# EAGLE design LabDuinoPorts (EAGLE 7.2.0)
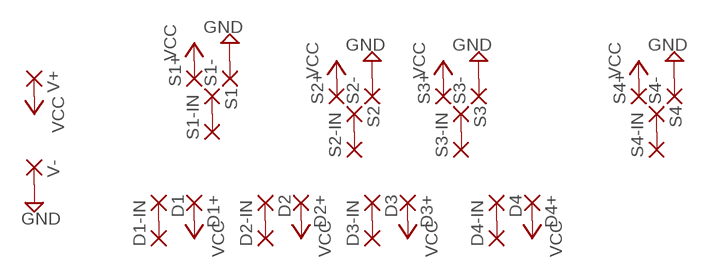
[diagram p0: schematic, sheet 1]

## Parts
D1  2,54/0,9  [2,54/0,9]
D1+  2,54/0,9  [2,54/0,9]
D1-IN  2,54/0,9  [2,54/0,9]
D2  2,54/0,9  [2,54/0,9]
D2+  2,54/0,9  [2,54/0,9]
D2-IN  2,54/0,9  [2,54/0,9]
D3  2,54/0,9  [2,54/0,9]
D3+  2,54/0,9  [2,54/0,9]
D3-IN  2,54/0,9  [2,54/0,9]
D4  2,54/0,9  [2,54/0,9]
D4+  2,54/0,9  [2,54/0,9]
D4-IN  2,54/0,9  [2,54/0,9]
S1  2,54/0,9  [2,54/0,9]
S1+  2,54/0,9  [2,54/0,9]
S1-  2,54/0,9  [2,54/0,9]
S1-IN  2,54/0,9  [2,54/0,9]
S2  2,54/0,9  [2,54/0,9]
S2+  2,54/0,9  [2,54/0,9]
S2-  2,54/0,9  [2,54/0,9]
S2-IN  2,54/0,9  [2,54/0,9]
S3  2,54/0,9  [2,54/0,9]
S3+  2,54/0,9  [2,54/0,9]
S3-  2,54/0,9  [2,54/0,9]
S3-IN  2,54/0,9  [2,54/0,9]
S4  2,54/0,9  [2,54/0,9]
S4+  2,54/0,9  [2,54/0,9]
S4-  2,54/0,9  [2,54/0,9]
S4-IN  2,54/0,9  [2,54/0,9]
V+  2,54/0,9  [2,54/0,9]
V-  2,54/0,9  [2,54/0,9]

## Nets
GND: S1-.1(P) S2-.1(P) S3-.1(P) S4-.1(P) V-.1(P)
N$1: S1-IN.1(P) S1.1(P)
N$2: S2-IN.1(P) S2.1(P)
N$3: S3-IN.1(P) S3.1(P)
N$4: S4-IN.1(P) S4.1(P)
N$5: D1-IN.1(P) D1.1(P)
N$6: D2-IN.1(P) D2.1(P)
N$7: D3-IN.1(P) D3.1(P)
N$8: D4-IN.1(P) D4.1(P)
VCC: D1+.1(P) D2+.1(P) D3+.1(P) D4+.1(P) S1+.1(P) S2+.1(P) S3+.1(P) S4+.1(P) V+.1(P)

## Library data of the parts
D1 D1+ D1-IN D2 D2+ D2-IN D3 D3+ D3-IN D4 D4+ D4-IN S1 S1+ S1- S1-IN S2 S2+ S2- S2-IN S3 S3+ S3- S3-IN S4 S4+ S4- S4-IN V+ V- = wirepad:2,54/0,9: THROUGH-HOLE PAD

## Net classes
0 default: width 0.381 mm, clearance 0.508 mm

## Board
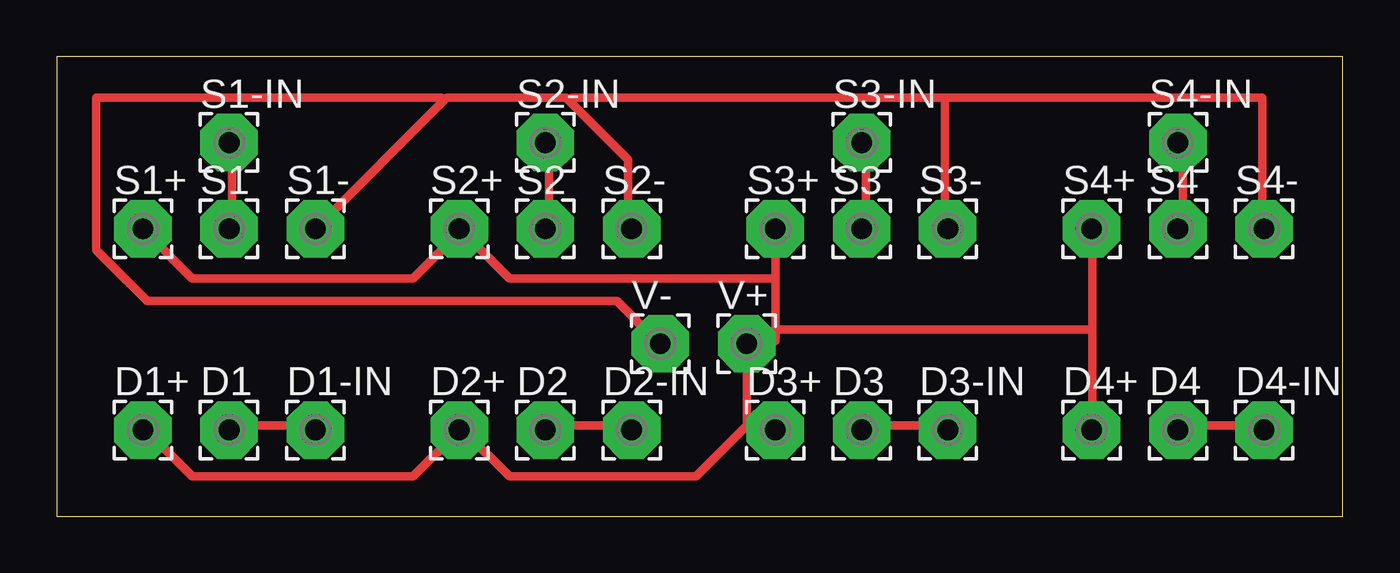
[diagram p1: board, top side]

Size 56.82 x 20.31 mm. Coordinates in mm from the lower left corner, seen from the top.
Outline: 0,0 56.82,0 56.82,20.31 0,20.31 0,0
Copper layers (1*16): Top 0.035mm / dielectric 1.5mm / Bottom 0.035mm
Design rules "default": minimum track width 10mil, minimum drill 24mil, track to track 8mil, track to pad 8mil, pad to pad 8mil, via to via 8mil, smd to smd 8mil, copper to edge 40mil, drill to drill 8mil, minimum pad ring 10mil, minimum via ring 8mil, stop-mask expansion 4mil, vias tented up to drill 0mil, thermal gap 10mil

### Footprints (pad centres in the part's own frame; a part is rotated, then mirrored left to right if it is on the bottom)
2,54/0,9 = drill 0.914 pad 2.54 octagon: 1 0,0

### Placement (x,y rotation side)
D1  7.62,3.81 0 top
D1+  3.81,3.81 0 top
D1-IN  11.43,3.81 0 top
D2  21.59,3.81 0 top
D2+  17.78,3.81 0 top
D2-IN  25.4,3.81 0 top
D3  35.56,3.81 0 top
D3+  31.75,3.81 0 top
D3-IN  39.37,3.81 0 top
D4  49.53,3.81 0 top
D4+  45.72,3.81 0 top
D4-IN  53.34,3.81 0 top
S1  7.62,12.7 0 top
S1+  3.81,12.7 0 top
S1-  11.43,12.7 0 top
S1-IN  7.62,16.51 0 top
S2  21.59,12.7 0 top
S2+  17.78,12.7 0 top
S2-  25.4,12.7 0 top
S2-IN  21.59,16.51 0 top
S3  35.56,12.7 0 top
S3+  31.75,12.7 0 top
S3-  39.37,12.7 0 top
S3-IN  35.56,16.51 0 top
S4  49.53,12.7 0 top
S4+  45.72,12.7 0 top
S4-  53.34,12.7 0 top
S4-IN  49.53,16.51 0 top
V+  30.48,7.62 0 top
V-  26.67,7.62 0 top

### Tracks (layer width: path | path; a pad name or v marks a point on that pad's centre or on a via)
GND
  Top 0.381: 17.12,18.38 17.25,18.5 22.5,18.5 22.62,18.38 | 17.12,18.38 11.5,12.75 S1-.1 | 22.62,18.38 25.25,15.75 25.25,12.75 S2-.1 | V-.1 26.5,7.75 24.75,9.5 4,9.5 1.75,11.75 1.75,18.5 17,18.5 17.12,18.38 | 39.25,18.5 39.25,12.75 S3-.1 | 39.25,18.5 22.75,18.5 22.62,18.38 | 39.25,18.5 53.25,18.5 53.25,12.75 S4-.1
N$1
  Top 0.381: S1.1 7.75,12.75 7.75,16.5 S1-IN.1
N$2
  Top 0.381: S2.1 21.75,12.75 21.75,16.5 S2-IN.1
N$3
  Top 0.381: S3.1 35.75,12.75 35.75,16.5 S3-IN.1
N$4
  Top 0.381: S4.1 49.75,12.75 49.75,16.5 S4-IN.1
N$5
  Top 0.381: D1.1 7.75,4 11.25,4 D1-IN.1
N$6
  Top 0.381: D2.1 21.75,4 25.25,4 D2-IN.1
N$7
  Top 0.381: D3.1 35.75,4 39.25,4 D3-IN.1
N$8
  Top 0.381: D4.1 49.75,4 53.25,4 D4-IN.1
VCC
  Top 0.381: S1+.1 4,12.5 6,10.5 15.75,10.5 17.75,12.5 S2+.1 18,12.5 20,10.5 31.75,10.5 | D1+.1 4,3.75 6,1.75 15.75,1.75 17.75,3.75 D2+.1 18,3.75 20,1.75 28.25,1.75 30.5,4 | 45.75,8.25 45.75,12.5 S4+.1 | 45.75,8.25 45.75,4 D4+.1 | 30.5,4 30.5,7.5 V+.1 30.5,7.75 31.75,7.75 31.75,8.25 | 30.5,4 31.75,4 D3+.1 30.5,4 | 31.75,8.25 31.75,10.5 | 31.75,10.5 S3+.1 | 31.75,8.25 45.75,8.25